# Altium schematic sheet Input.SchDoc
size A4
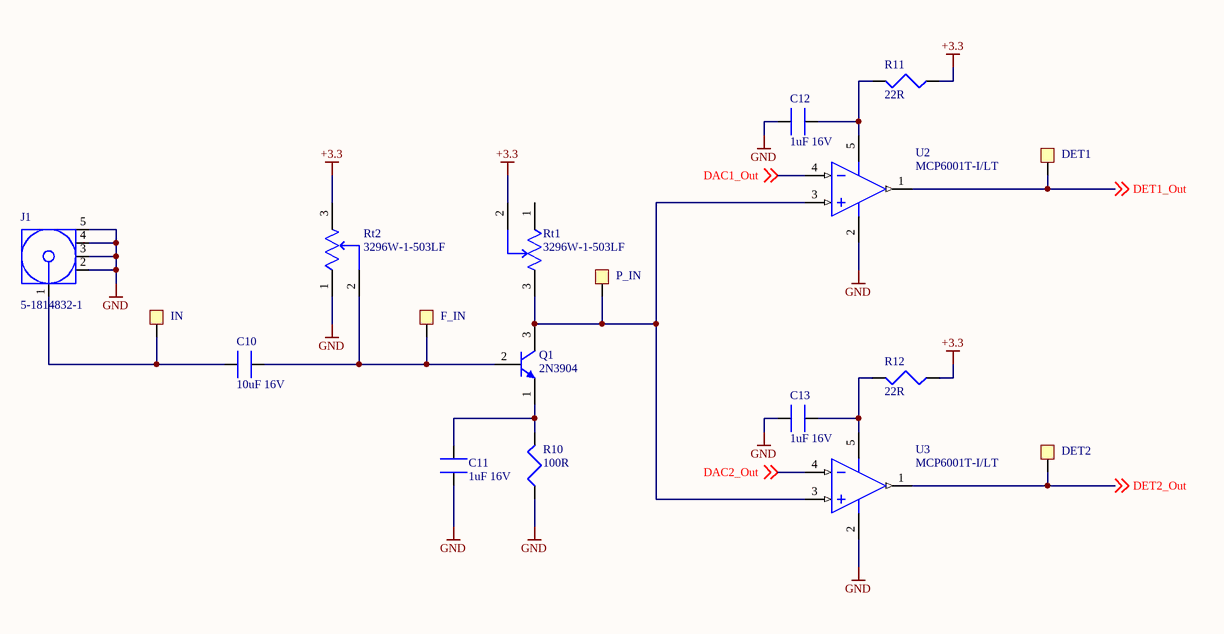
[diagram p0: Input.SchDoc]

## Parts
C10  10uF 16V  [0805_C]
C11  1uF 16V  [0805_C]
C12  1uF 16V  [0805_C]
C13  1uF 16V  [0805_C]
DET1  Point  [Test_Point]  (value not drawn)
DET2  Point  [Test_Point]  (value not drawn)
F_IN  Point  [Test_Point]  (value not drawn)
IN  Point  [Test_Point]  (value not drawn)
J1  5-1814832-1  [TECO-5-1814832-1_V]
P_IN  Point  [Test_Point]  (value not drawn)
Q1  2N3904  [ONSC-TO-92-3-29-11]
R10  100R  [0805_R]
R11  22R  [0805_R]
R12  22R  [0805_R]
Rt1  3296W-1-503LF  [FP-3296W-MFG]
Rt2  3296W-1-503LF  [FP-3296W-MFG]
U2  MCP6001T-I/LT  [SC70-LT5_M]
U3  MCP6001T-I/LT  [SC70-LT5_M]

## Nets
+3.3: R11.2 R12.2 Rt1.2(WIPER) Rt2.3(CW)
GND: C11.1 C12.2 C13.2 J1.2 J1.3 J1.4 J1.5 R10.2 Rt2.1(CCW) U2.2(VSS) U3.2(VSS)
DAC1_Out: U2.4(VIN-) ; off-sheet DAC1_Out
DAC2_Out: U3.4(VIN-) ; off-sheet DAC2_Out
DET1_Out: DET1.1 U2.1(VOUT) ; off-sheet DET1_Out
DET2_Out: DET2.1 U3.1(VOUT) ; off-sheet DET2_Out
NetC10_1: C10.1 IN.1 J1.1
NetC10_2: C10.2 F_IN.1 Q1.2(B) Rt2.2(WIPER)
NetC11_2: C11.2 Q1.1(E) R10.1
NetC12_1: C12.1 R11.1 U2.5(VDD)
NetC13_1: C13.1 R12.1 U3.5(VDD)
NetP_IN_1: P_IN.1 Q1.3(C) Rt1.3(CW) U2.3(VIN+) U3.3(VIN+)

Not connected (* = marked no-connect by the designer): Rt1 1(CCW)

## Library data of the parts
C10-C13 = Cap
J1 = CMP-2000-05415-1: SMA Connector, Pitch 5.08 mm, 1 Position, Height 9.5 mm, Tail Length 4 mm, -65 to 165 degC, RoHS, Bulk; Manufacturer: TE Connectivity; Connector Mounting: PCBMount; Connector Body Style: StraightJack; Impedance: 50ohm; Coaxial Termination: Solder; SVHC: NoSVHC(15-Jun-2015); Frequency Max: 3GHz; Product Range: ZDCSeries; Connector Type: SMACoaxial; Datasheet Version: Rev. B1, 03/2011; Package Reference: 5-1814832-1; Package Description: SMA Connector, Pitch 5.08 mm, 1 Position, Height 9.5 mm, Tail Length 4 mm; Contact Plating: GoldPlatedContacts; Coaxial Cable Types: -; Contact Material: BerylliumCopper; Manufacturer URL: http://www.te.com/; Datasheet URL: http://www.onlinecomponents.com/productFiles/mf-AMP/eng_cd_1814832_a.pdf
Q1 = CMP-2000-05562-1: General Purpose Transistor, NPN Silicon, 200 mA, 60 V, -55 to 150 degC, 3-Pin TO-92, RoHS, Bulk; Manufacturer: ONSemiconductor; Emitter- Base Voltage VEBO: 6V; Maximum Power Dissipation: 625mW; Maximum DC Collector Current: 0.2A; Collector- Emitter Voltage VCEO Max: 40V; Collector- Base Voltage VCBO: 60V; DC Collector/Base Gain hfe Min: 60; Configuration: Single; Collector-Emitter Saturation Voltage: 0.3V; Gain Bandwidth Product fT: 270MHz; Mounting Style: ThroughHole; Package / Case: TO-92-3(TO-226); Mounting Technology: ThroughHole; Minimum Operating Temperature: -65C; Datasheet Version: Rev. 8, 08/2012; Product Category: BipolarTransistors-BJT; Factory Pack Quantity: 5000; Transistor Polarity: NPN; Package Description: 3-Pin Transistor Outline, Body 4.825 x 3.685 mm, Pitch 1.27 mm; RoHS: Details; Datasheet URL: https://datasheet.ciiva.com/4725/2n3903-d-285841-4725808.pdf; Packaging: Bulk; Maximum Operating Temperature: +150C; Package Reference: TO-92-3-29-11; Brand: ONSemiconductor; Manufacturer URL: http://www.onsemi.com/
R10-R12 = Res
Rt1 Rt2 = CMP-2000-05583-2: TRIMMER 50K OHM 0.5W PC PIN TOP; Manufacturer: Bourns; Manufacturer Part Number: 3296W-1-504LF; Resistance: 500kΩ; Temperature Coefficient: 100ppm/°C; Value: 500kΩ; Tolerance: 10%; Voltage Rating: 300V; Standoff Height: 0.38mm; ComponentLink2Description: Datasheet; Package: 3296W; Series: Trimpot 3296-Sealed; Lead Free: Yes; Octopart: https://octopart.com/3296w-1-504lf-bourns-143884; Device Class L2: Resistors; Automotive: No; RoHS: TRUE; Temperature Range High: +125°C; Height: 12.05mm; Power Rating: 0.5W; Temperature Range Low: -55°C; ComponentLink2URL: https://www.bourns.com/docs/Product-Datasheets/3296.pdf; Device Class L1: Passive Components; Device Class L3: Variable Resistors and Potentiometers; Category: Res; Temperature: -55°C to +125°C; Digikey Description: TRIMMER 500K OHM 0.5W PC PIN TOP; Mouser Description: Trimmer; Cermet; Rest 500 Kilohms; PCB; 25 Turns; Pwr-Rtg 0.5W
U2 U3 = CMP-0187-00457-2: 1 MHz, Low-Power Operational Amplifier, 5-Pin SC-70, Industrial Temperature, Tape and Reel; RevisionNote: URLs added.; ComponentLink2Description: Datasheet; ComponentLink3URL: http://www.microchip.com/stellent/groups/techpub_sg/documents/packagingspec/en012702.pdf; PackageReference: SC70-LT5; PackageDescription: 5-Lead Plastic Small Outline Transistor (LT) [SC70]; ComponentLink2URL: http://ww1.microchip.com/downloads/en/DeviceDoc/21733j.pdf; ComponentLink3Description: Package Specification; PackageVersion: revBB, Aug-2009; ComponentLink1Description: Manufacturer URL; DatasheetVersion: revJ, Nov-2009; ComponentLink1URL: http://www.microchip.com/; Code_IPC: SOT353-5